# EAGLE design SingleToggleBreakout (EAGLE 6.5.0)
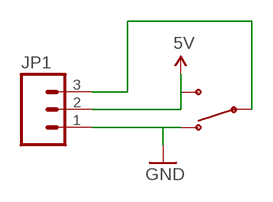
[diagram p0: schematic, sheet 1]

## Parts
JP1  M03PTH  [1X03]
U$1  SPDTSPDT  [TOGGLE_SPDT]

## Nets
5V: JP1.2 U$1.3
GND: JP1.1 U$1.1
N$3: JP1.3 U$1.2

## Library data of the parts
JP1 = SparkFun-Connectors:M03: Header 3 Standard 3-pin 0.1" header. Use with straight break away headers (SKU : PRT-00116), right angle break away headers (PRT-00553), swiss pins (PRT-00743), machine pins (PRT-00117), and female headers (PRT-00115). Molex polarized connector foot print use with SKU : PRT-08232 with associated crimp pins and housings.
U$1 = barbary_enterprises:SPDT

## Board
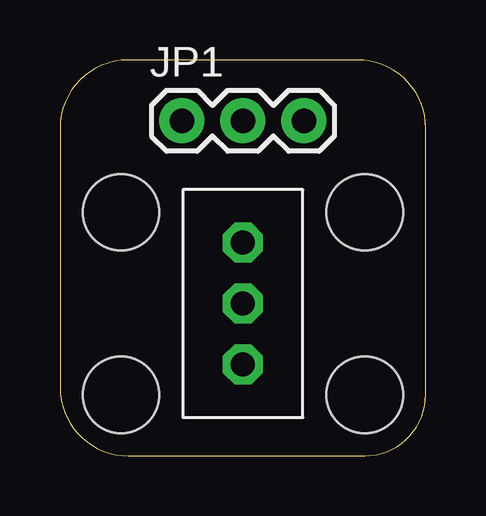
[diagram p1: board, top side]
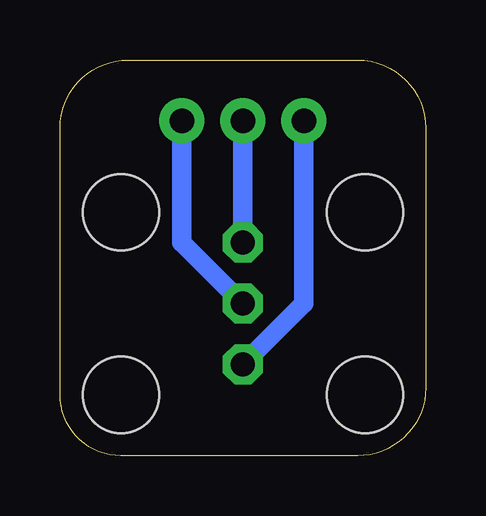
[diagram p2: board, bottom side, seen from below]

Size 15.24 x 16.51 mm. Coordinates in mm from the lower left corner, seen from the top.
Outline: 12.4,16.51 2.83,16.5 arc90 0,13.67 0,2.84 arc90 2.84,0 12.7,0 arc90 15.24,2.54 15.24,13.67 arc90 12.4,16.51
Copper layers (1*16): Top 0.035mm / dielectric 1.5mm / Bottom 0.035mm
Design rules "default": minimum track width 10mil, minimum drill 24mil, track to track 8mil, track to pad 8mil, pad to pad 8mil, via to via 8mil, smd to smd 8mil, copper to edge 40mil, drill to drill 8mil, minimum pad ring 10mil, minimum via ring 8mil, stop-mask expansion 4mil, vias tented up to drill 0mil, thermal gap 10mil
Holes 3.17 mm at 2.54,2.54 2.54,10.16 12.7,10.16 12.7,2.54

### Footprints (pad centres in the part's own frame; a part is rotated, then mirrored left to right if it is on the bottom)
1X03 = drill 1.016 pad 1.88: 1 0,0; 2 2.54,0; 3 5.08,0
TOGGLE_SPDT = drill 1 pad 1.676 octagon: 1 0,2.54; 2 0,0; 3 0,-2.54

### Placement (x,y rotation side)
JP1  5.08,13.97 0 top
U$1  7.62,6.35 180 top

### Tracks (layer width: path | path; a pad name or v marks a point on that pad's centre or on a via)
5V
  Bottom 0.813: U$1.3 JP1.2
GND
  Bottom 0.813: U$1.1 5.08,6.35 JP1.1
N$3
  Bottom 0.813: U$1.2 10.16,8.89 JP1.3